# EAGLE schematic tian_light_rgb_revd (EAGLE 6.1)
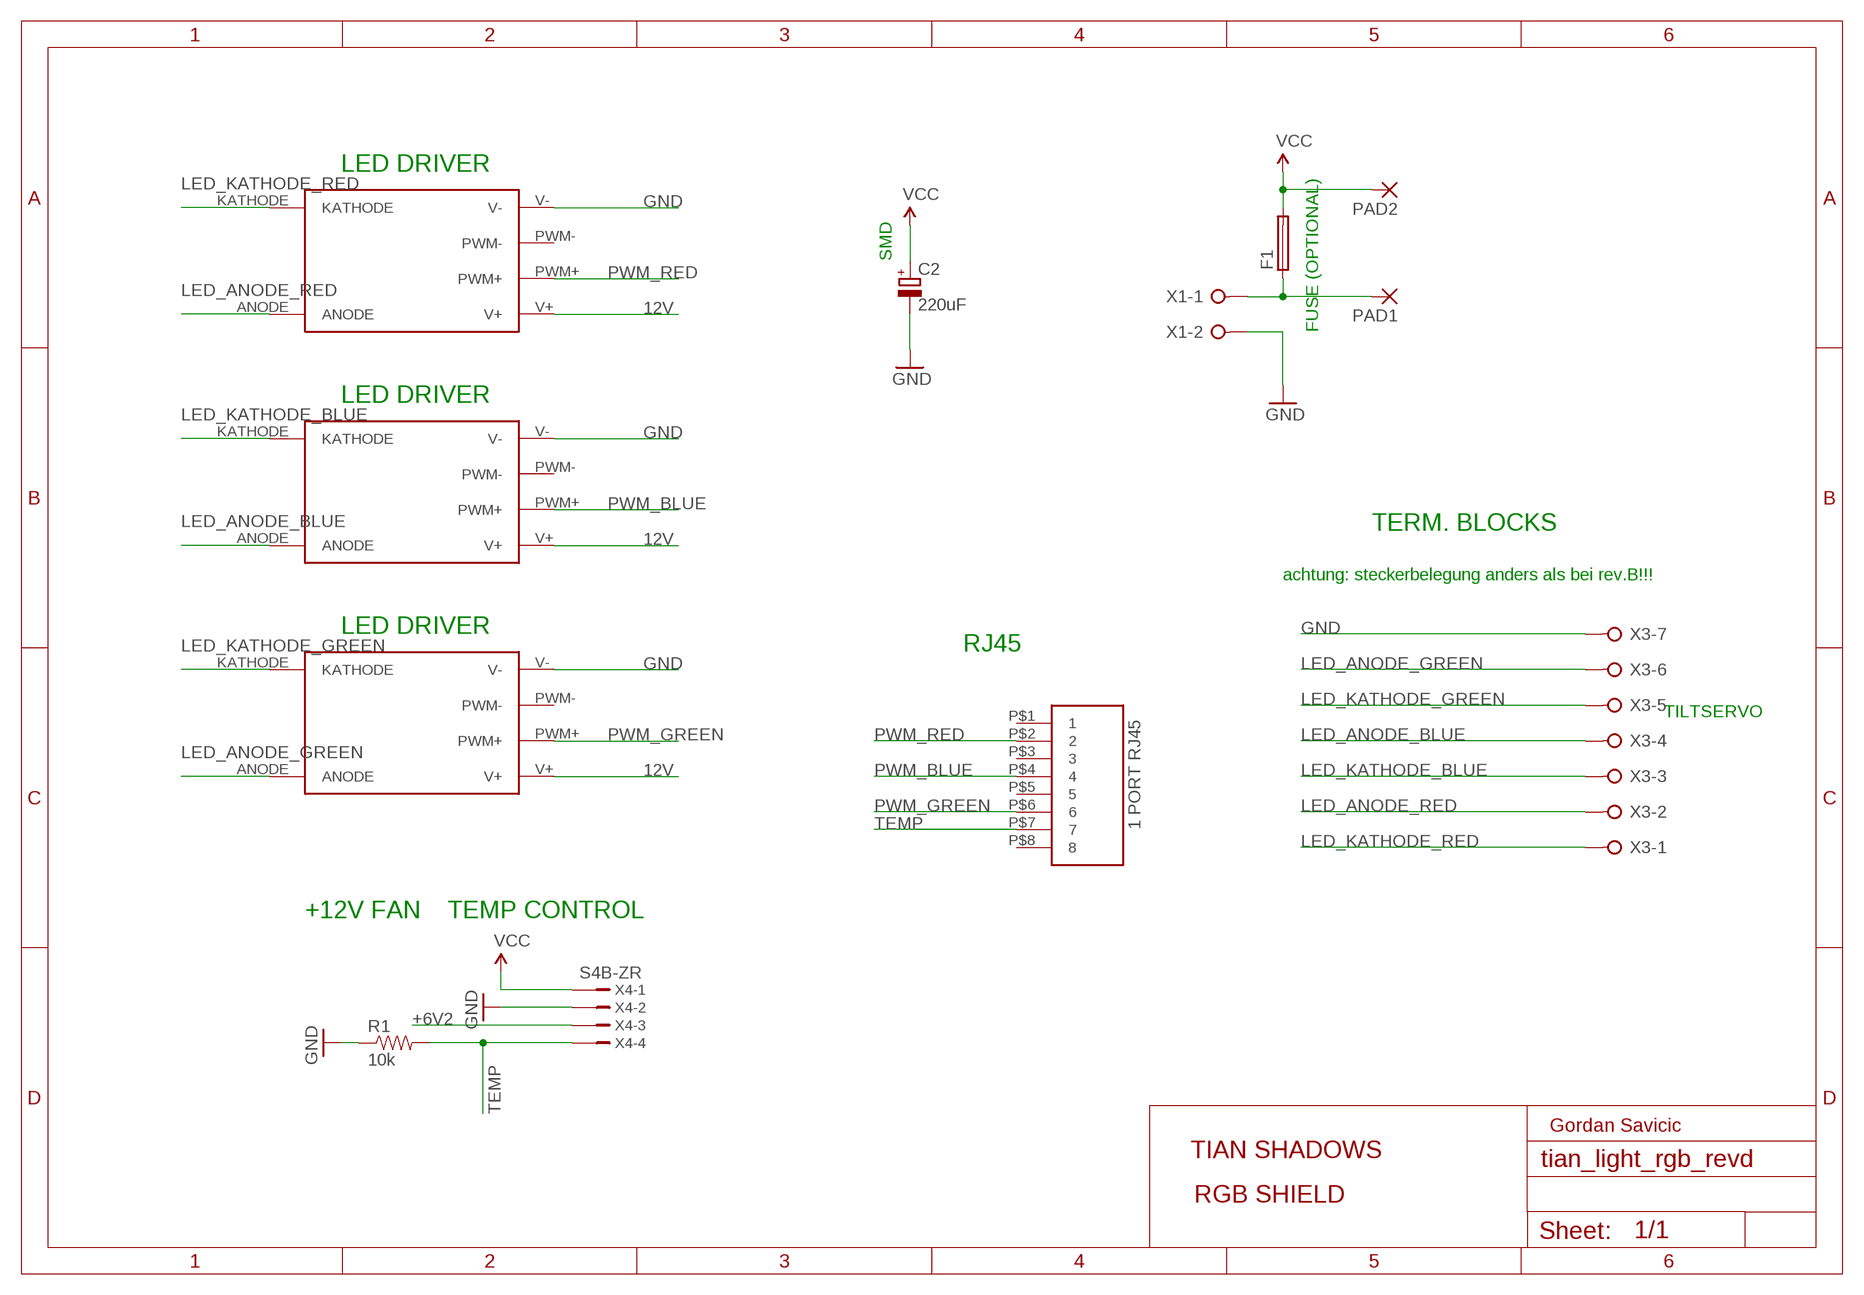
[diagram p0: schematic, sheet 1]

## Parts
C2  220uF  CPOL-EUF  [PANASONIC_F]
F1  SH22,5  [SH22,5]
PAD1  2,15/1,0  [2,15/1,0]
PAD2  2,15/1,0  [2,15/1,0]
R1  10k  RESISTOR1206  [1206]
U$1  BUCK_LED_DRIVER  [BUCK_LED_DRIVER]
U$2  BUCK_LED_DRIVER  [BUCK_LED_DRIVER]
U$3  BUCK_LED_DRIVER  [BUCK_LED_DRIVER]
U$5  1PORT_ETHERNET  [1PORT_ETHERNET]
X1  W237-02P  [W237-132]
X3  W237-07P  [W237-7P]
X4  S4B-ZR  [S4B-ZR]

## Nets
12V: C2.+ F1.2 PAD2.1(P) U$1.V+ U$2.V+ U$3.V+ X4.1 ; supply symbol labelled VCC
+6V2: X4.3
GND: C2.- R1.1 U$1.V- U$2.V- U$3.V- X1.2 X3.7 X4.2
LED_ANODE_BLUE: U$2.ANODE X3.4
LED_ANODE_GREEN: U$3.ANODE X3.6
LED_ANODE_RED: U$1.ANODE X3.2
LED_KATHODE_BLUE: U$2.KATHODE X3.3
LED_KATHODE_GREEN: U$3.KATHODE X3.5
LED_KATHODE_RED: U$1.KATHODE X3.1
N$1: F1.1 PAD1.1(P) X1.1
PWM_BLUE: U$2.PWM+ U$5.P$4
PWM_GREEN: U$3.PWM+ U$5.P$6
PWM_RED: U$1.PWM+ U$5.P$2
TEMP: R1.2 U$5.P$7 X4.4
Unconnected: U$1.PWM- U$2.PWM- U$3.PWM- U$5.P$1 U$5.P$3 U$5.P$5 U$5.P$8

## Notes on the sheet
- LED DRIVER
- SMD
- FUSE (OPTIONAL)
- LED DRIVER
- TERM. BLOCKS
- achtung: steckerbelegung anders als bei rev.B!!!
- LED DRIVER
- RJ45
- TILTSERVO
- +12V FAN | TEMP CONTROL
- Gordan Savicic
- TIAN SHADOWS
- RGB SHIELD

## Library data of the parts
C2 = rcl:CPOL-EU: POLARIZED CAPACITOR, European symbol
F1 = fuse:SH22,5: FUSE HOLDER grid 22,5 mm, OGN0031 8201, Schurter (Buerklin); MF: SCHURTER; MPN: 0031.8201; OC_FARNELL: 1162740; OC_NEWARK: 96F8317
PAD1 PAD2 = wirepad:2,15/1,0: THROUGH-HOLE PAD
R1 = SparkFun:RESISTOR: Resistor Basic schematic elements and footprints for 0603, 1206, and PTH resistors.
U$1-U$3 = tian:BUCK_LED_DRIVER
U$5 = strukt:1PORT_ETHERNET
X1 = con-wago-508:W237-02P: WAGO SREW CLAMP; OC_FARNELL: unknown; OC_NEWARK: unknown
X3 = con-wago-508:W237-07P: WAGO SREW CLAMP; OC_FARNELL: unknown; OC_NEWARK: unknown
X4 = con-jst:?4B-ZR: ZH CONNECTOR 1.5 mm, 4 pin 1 row Source: http://www.jst.com .. eZH.pdf; MF: FARNELL; MPN: S4B-ZR(LF)(SN); OC_FARNELL: 9491830; OC_NEWARK: 38K8076